# EAGLE schematic Masa Yardımcısı (EAGLE 9.6.2)
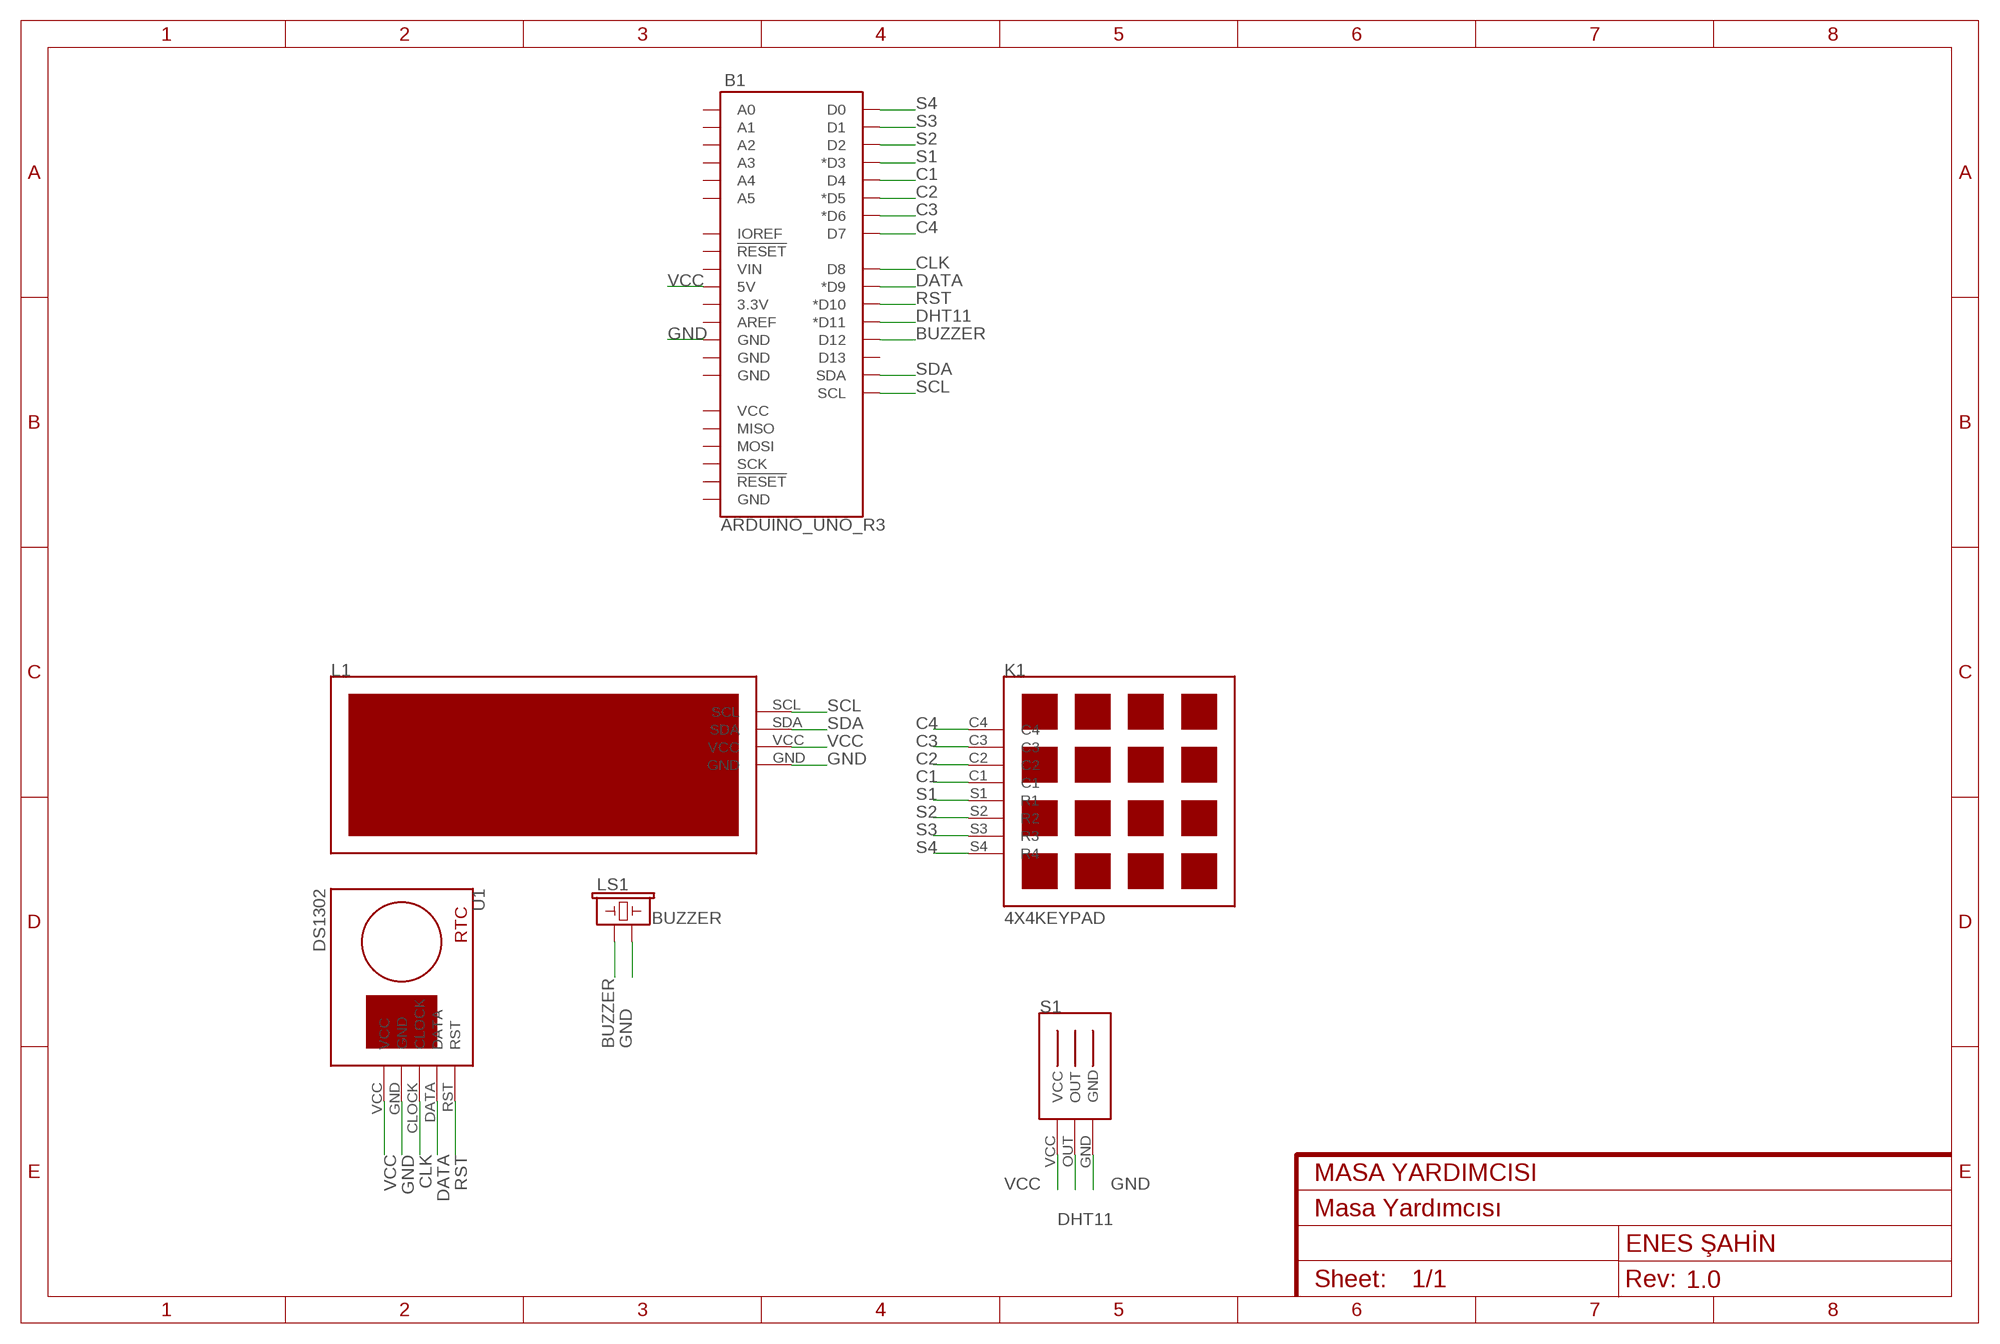
[diagram p0: schematic, sheet 1]
FRAME1 (FRAME-A4L): CNAME: MASA YARDIMCISI; CREVISION: 1.0; DESIGNER: ENES ŞAHİN

## Parts
B1  ARDUINO_UNO_R3  [ARDUINO_R3]
K1  4X4KEYPAD  4X4_KEYPAD  [4X4_KEYPAD]
L1  16X2_LCD  [16X2_LCD]
LS1  BUZZER  BUZZER-PTH  [BUZZER-12MM]
S1  DHT11  [DHT11]
U1  DS1302  [DS1302]

## Nets
BUZZER: B1.D12 LS1.+
C1: B1.D4 K1.C1
C2: B1.D5(*D5) K1.C2
C3: B1.D6(*D6) K1.C3
C4: B1.D7 K1.C4
CLK: B1.D8 U1.CLOCK
DATA: B1.D9(*D9) U1.DATA
DHT11: B1.D11(*D11) S1.OUT
GND: B1.GND@4(GND) L1.GND LS1.- S1.GND U1.GND
RST: B1.D10(*D10) U1.RST
S1: B1.D3(*D3) K1.S1(R1)
S2: B1.D2 K1.S2(R2)
S3: B1.D1 K1.S3(R3)
S4: B1.D0 K1.S4(R4)
SCL: B1.SCL L1.SCL
SDA: B1.SDA L1.SDA
VCC: B1.5V L1.VCC S1.VCC U1.VCC
Unconnected: B1.3.3V B1.A0 B1.A1 B1.A2 B1.A3 B1.A4 B1.A5 B1.AREF B1.D13 B1.GND@1(GND) B1.GND@2(GND) B1.GND@3(GND) B1.IOREF B1.MISO B1.MOSI B1.RESET@1(!RESET!) B1.RESET@2(!RESET!) B1.SCK B1.VCC B1.VIN

## Library data of the parts
B1 = SparkFun-Boards:ARDUINO_UNO_R3: Arduino R3 Footprint with SPI header Arduino Uno R3 Compatible Footprint. Matches PCB size of the original board. SparkFun Products: SAMD21 Dev Breakout <https://www.sparkfun.com/products/13672> RedBoard <https://www.sparkfun.com/products/12757> R3 Stackable Headers <https://www.sparkfun.com/products/11417>
K1 = MASA YARDIMCISI:4X4_KEYPAD
L1 = MASA YARDIMCISI:16X2_LCD
LS1 = SparkFun-Electromechanical:BUZZER: Buzzer Small round buzzers that operate around the audible 2kHz range. You can use these as speakers to create simple music or user interfaces. Variant Overview: PTH - Mini Speaker - PC Mount 12mm 2.048kHz <https://www.sparkfun.com/products/7950> PTH_KIT - Mini Speaker - PC Mount 12mm 2.048kHz <https://www.sparkfun.com/products/7950> KIT simplifies soldering by adding stop mask to one side of the pads. PTH_NO_SILK - Mini Speaker - PC Mount 12mm 2.048kHz <https://www.sparkfun.com/products/7950> No silkscreen indicator of buzzer outline. PTH_KIT_NO_SILK - Mini Speaker - PC Mount 12mm 2.048kHz <https://www.sparkfun.com/products/7950> KIT package w/o silkscreen SMD - Buzzer Audio Magnetic (CCV-084B16) SMD buzzer used on, e.g. the LilyPad Buzzer <https://www.sparkfun.com/products/8463> and RFID USB Reader <https://www.sparkfun.com/products/9963>. SMD_KIT - Buzzer Audio Magnetic (CCV-084B16) SMD Buzzer with elongated pins to make soldering easier. Used on the SparkFun Simon Says - Surface Mount Soldering Kit <https://www.sparkfun.com/products/10935>.; PROD_ID: COMP-08253; SF_SKU: COM-07950
S1 = MASA YARDIMCISI:DHT11
U1 = MASA YARDIMCISI:DS1302